# Altium schematic sheet SCT12A0 BOOST.SchDoc
size A4; Organization: Altium Limited; Address1: L3, 12a Rodborough Rd; Address2: Frenchs Forest; Address3: NSW; Address4: Australia 2086
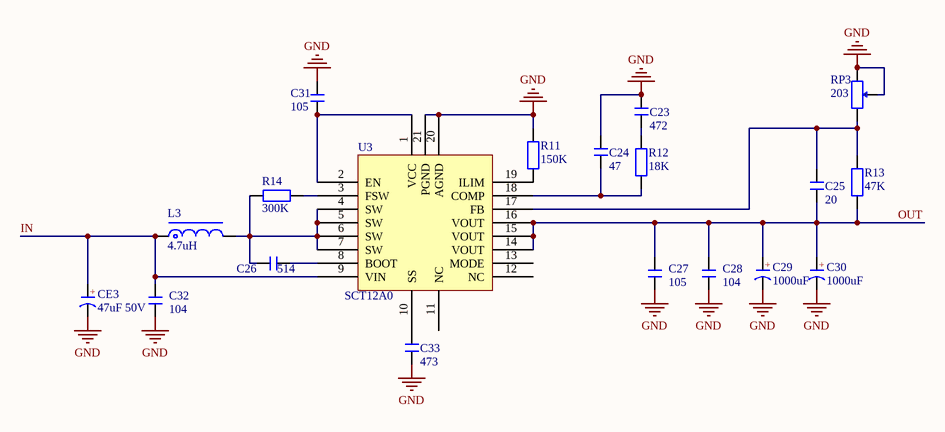
[diagram p0: SCT12A0 BOOST.SchDoc]

## Parts
C23  472  [C 0805_L]
C24  47  [C 0805_L]
C25  20  [C 0805_L]
C26  514  [C 0805_L]
C27  105  [C 0805_L]
C28  104  [C 0805_L]
C29  1000uF  [CAP 7.5*16*25]
C30  1000uF  [CAP 5.0*12.5*20]
C31  105  [C 0805_L]
C32  104  [C 0805_L]
C33  473  [C 0805_L]
CE3  47uF 50V  [CM C(5*5.4)]
L3  4.7uH  [CDRH127]
R11  150K  [R 0805_L]
R12  18K  [R 0805_L]
R13  47K  [R 0805_L]
R14  300K  [R 0805_L]
RP3  203  [3296W]
U3  SCT12A0  [DFN-20L (3.5x4.5)]

## Nets
GND: C23.1 C24.1 C27.1 C28.1 C29.2(K) C30.2(K) C31.1 C32.1 C33.1 CE3.2(K) R11.1 RP3.1 RP3.2 U3.20(AGND) U3.21(PGND)
IN: C32.2 CE3.1(A) L3.1 U3.9(VIN)
OUT: C25.2 C27.2 C28.2 C29.1(A) C30.1(A) R13.2 U3.14(VOUT) U3.15(VOUT) U3.16(VOUT)
NetC23_2: C23.2 R12.1
NetC24_2: C24.2 R12.2 U3.18(COMP)
NetC25_1: C25.1 R13.1 RP3.3 U3.17(FB)
NetC26_1: C26.1 U3.8(BOOT)
NetC26_2: C26.2 L3.2 R14.1 U3.4(SW) U3.5(SW) U3.6(SW) U3.7(SW)
NetC31_2: C31.2 U3.1(VCC) U3.2(EN)
NetC33_2: C33.2 U3.10(SS)
NetR11_2: R11.2 U3.19(ILIM)
NetR14_2: R14.2 U3.3(FSW)

Not connected (* = marked no-connect by the designer): U3 11(NC) 12(NC) 13(MODE)

## Notes on the sheet
- Title
- Size:
- Date:
- File:
- A0
- Number:
- Time:
- Revision:
- Sheet
- of
- (in symbol CE) +
- (in symbol CE_SMD) +

## Library data of the parts
C23-C28 C31-C33 = C: 贴片电容; 淘宝ID: 小糖豆的小窝窝; BOM名称: 贴片电容; 下单链接: https://item.taobao.com/item.htm?ft=t&id=613637044352
C29 C30 = CE: 直插电解电容; 淘宝ID: 小糖豆的小窝窝; BOM名称: 直插电解电容; 下单链接: https://item.taobao.com/item.htm?ft=t&id=613637044352
CE3 = CE_SMD: 贴片电解电容; 淘宝ID: 小糖豆的小窝窝; BOM名称: 贴片电解电容; 下单链接: https://item.taobao.com/item.htm?ft=t&id=613637044352
L3 = L-CDRH: 功率屏蔽电感; 淘宝ID: 小糖豆的小窝窝; BOM名称: 功率屏蔽电感; 下单链接: https://item.taobao.com/item.htm?ft=t&id=613637044352
R11-R14 = R: 贴片电阻; 淘宝ID: 小糖豆的小窝窝; BOM名称: 贴片电阻; 下单链接: https://item.taobao.com/item.htm?ft=t&id=613637044352
RP3 = RP: 单联电位器; 淘宝ID: 小糖豆的小窝窝; BOM名称: 单联电位器; 下单链接: https://item.taobao.com/item.htm?ft=t&id=613637044352